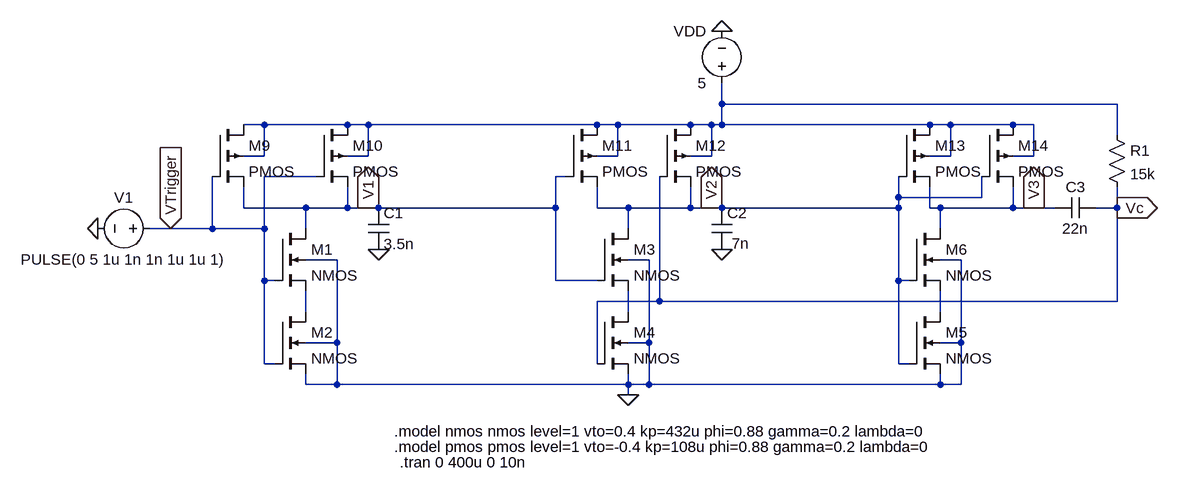
[diagram p0: schematic Lab05Pt2.asc]
Lab05Pt2.asc, the LTspice schematic file:
Version 4
SHEET 1 1176 680
WIRE 480 -112 480 -144
WIRE 1088 -112 480 -112
WIRE -224 -80 -256 -80
WIRE -96 -80 -224 -80
WIRE -64 -80 -96 -80
WIRE 288 -80 -64 -80
WIRE 320 -80 288 -80
WIRE 432 -80 320 -80
WIRE 464 -80 432 -80
WIRE 480 -80 480 -112
WIRE 480 -80 464 -80
WIRE 800 -80 480 -80
WIRE 832 -80 800 -80
WIRE 928 -80 832 -80
WIRE 960 -80 928 -80
WIRE 1088 -64 1088 -112
WIRE -224 -32 -224 -80
WIRE -224 -32 -256 -32
WIRE -64 -32 -64 -80
WIRE -64 -32 -96 -32
WIRE 320 -32 320 -80
WIRE 320 -32 288 -32
WIRE 464 -32 464 -80
WIRE 464 -32 432 -32
WIRE 832 -32 832 -80
WIRE 832 -32 800 -32
WIRE 960 -32 960 -80
WIRE 960 -32 928 -32
WIRE -144 0 -224 0
WIRE 240 0 224 0
WIRE 752 32 752 0
WIRE 880 32 880 0
WIRE 880 32 752 32
WIRE -256 48 -256 16
WIRE -160 48 -256 48
WIRE -96 48 -96 16
WIRE -96 48 -160 48
WIRE -64 48 -96 48
WIRE -48 48 -64 48
WIRE 224 48 224 0
WIRE 224 48 -48 48
WIRE 288 48 288 16
WIRE 336 48 288 48
WIRE 432 48 432 16
WIRE 432 48 336 48
WIRE 464 48 432 48
WIRE 480 48 464 48
WIRE 752 48 752 32
WIRE 752 48 480 48
WIRE 800 48 800 16
WIRE 816 48 800 48
WIRE 928 48 928 16
WIRE 928 48 816 48
WIRE 960 48 928 48
WIRE 992 48 960 48
WIRE 1088 48 1088 16
WIRE 1088 48 1056 48
WIRE -368 80 -400 80
WIRE -304 80 -304 0
WIRE -304 80 -368 80
WIRE -224 80 -224 0
WIRE -224 80 -304 80
WIRE -160 80 -160 48
WIRE 336 80 336 48
WIRE 816 80 816 48
WIRE -112 128 -160 128
WIRE 368 128 336 128
WIRE 848 128 816 128
WIRE -224 160 -224 80
WIRE -208 160 -224 160
WIRE 224 160 224 48
WIRE 288 160 224 160
WIRE 752 160 752 48
WIRE 768 160 752 160
WIRE 384 192 384 0
WIRE 384 192 288 192
WIRE 1088 192 1088 48
WIRE 1088 192 384 192
WIRE -160 208 -160 176
WIRE 336 208 336 176
WIRE 816 208 816 176
WIRE -112 256 -112 128
WIRE -112 256 -160 256
WIRE 368 256 368 128
WIRE 368 256 336 256
WIRE 848 256 848 128
WIRE 848 256 816 256
WIRE -224 288 -224 160
WIRE -208 288 -224 288
WIRE 288 288 288 192
WIRE 752 288 752 160
WIRE 768 288 752 288
WIRE -160 320 -160 304
WIRE -112 320 -112 256
WIRE -112 320 -160 320
WIRE 336 320 336 304
WIRE 336 320 -112 320
WIRE 368 320 368 256
WIRE 368 320 336 320
WIRE 816 320 816 304
WIRE 816 320 368 320
WIRE 848 320 848 256
WIRE 848 320 816 320
WIRE 336 336 336 320
FLAG 480 -224 0
FLAG 960 48 V3
IOPIN 960 48 Out
FLAG -64 48 V1
IOPIN -64 48 Out
FLAG -48 112 0
FLAG 480 112 0
FLAG 464 48 V2
IOPIN 464 48 Out
FLAG 336 336 0
FLAG -368 80 VTrigger
IOPIN -368 80 In
FLAG -480 80 0
FLAG 1088 48 Vc
IOPIN 1088 48 Out
SYMBOL nmos4 -208 80 R0
SYMATTR InstName M1
SYMATTR Value2 l=0.1u w=4u
SYMBOL nmos4 -208 208 R0
SYMATTR InstName M2
SYMATTR Value2 l=0.1u w=4u
SYMBOL nmos4 288 80 R0
SYMATTR InstName M3
SYMATTR Value2 l=0.1u w=4u
SYMBOL nmos4 288 208 R0
SYMATTR InstName M4
SYMATTR Value2 l=0.1u w=4u
SYMBOL nmos4 768 208 R0
SYMATTR InstName M5
SYMATTR Value2 l=0.1u w=4u
SYMBOL nmos4 768 80 R0
SYMATTR InstName M6
SYMATTR Value2 l=0.1u w=4u
SYMBOL pmos4 -304 -80 R0
SYMATTR InstName M9
SYMATTR Value2 l=0.1u w=4u
SYMBOL pmos4 -144 -80 R0
SYMATTR InstName M10
SYMATTR Value2 l=0.1u w=4u
SYMBOL pmos4 240 -80 R0
SYMATTR InstName M11
SYMATTR Value2 l=0.1u w=4u
SYMBOL pmos4 384 -80 R0
SYMATTR InstName M12
SYMATTR Value2 l=0.1u w=4u
SYMBOL pmos4 752 -80 R0
SYMATTR InstName M13
SYMATTR Value2 l=0.1u w=4u
SYMBOL pmos4 880 -80 R0
SYMATTR InstName M14
SYMATTR Value2 l=0.1u w=4u
SYMBOL voltage 480 -128 R180
WINDOW 0 24 96 Left 2
WINDOW 3 24 16 Left 2
WINDOW 123 0 0 Left 0
WINDOW 39 0 0 Left 0
SYMATTR InstName VDD
SYMATTR Value 5
SYMBOL cap -64 48 R0
SYMATTR InstName C1
SYMATTR Value 3.5n
SYMBOL cap 464 48 R0
WINDOW 3 31 55 Left 2
SYMATTR InstName C2
SYMATTR Value 7n
SYMBOL res 1072 -80 R0
SYMATTR InstName R1
SYMATTR Value 15k
SYMBOL cap 1056 32 R90
WINDOW 0 0 32 VBottom 2
WINDOW 3 32 32 VTop 2
SYMATTR InstName C3
SYMATTR Value 22n
SYMBOL voltage -384 80 R90
WINDOW 0 -32 56 VBottom 2
WINDOW 3 32 56 VTop 2
WINDOW 123 0 0 Left 0
WINDOW 39 0 0 Left 0
SYMATTR InstName V1
SYMATTR Value PULSE(0 5 1u 1n 1n 1u 1u 1)
TEXT -24 392 Left 2 !.model nmos nmos level=1 vto=0.4 kp=432u phi=0.88 gamma=0.2 lambda=0
TEXT -24 416 Left 2 !.model pmos pmos level=1 vto=-0.4 kp=108u phi=0.88 gamma=0.2 lambda=0
TEXT -16 440 Left 2 !.tran 0 400u 0 10n

The netlist it stands for:
* Lab05Pt2.asc
M1 V1 VTrigger N002 0 NMOS l=0.1u w=4u
M2 N002 VTrigger 0 0 NMOS l=0.1u w=4u
M3 V2 V1 N003 0 NMOS l=0.1u w=4u
M4 N003 Vc 0 0 NMOS l=0.1u w=4u
M5 N004 V2 0 0 NMOS l=0.1u w=4u
M6 V3 V2 N004 0 NMOS l=0.1u w=4u
M9 N001 VTrigger V1 N001 PMOS l=0.1u w=4u
M10 N001 VTrigger V1 N001 PMOS l=0.1u w=4u
M11 N001 V1 V2 N001 PMOS l=0.1u w=4u
M12 N001 Vc V2 N001 PMOS l=0.1u w=4u
M13 N001 V2 V3 N001 PMOS l=0.1u w=4u
M14 N001 V2 V3 N001 PMOS l=0.1u w=4u
VDD N001 0 5
C1 V1 0 3.5n
C2 V2 0 7n
R1 N001 Vc 15k
C3 Vc V3 22n
V1 VTrigger 0 PULSE(0 5 1u 1n 1n 1u 1u 1)
.model NMOS NMOS
.model PMOS PMOS
.lib standard.mos
.model nmos nmos level=1 vto=0.4 kp=432u phi=0.88 gamma=0.2 lambda=0
.model pmos pmos level=1 vto=-0.4 kp=108u phi=0.88 gamma=0.2 lambda=0
.tran 0 400u 0 10n
.backanno
.end

* Results of the author's LTspice run, read from the files saved beside the schematic
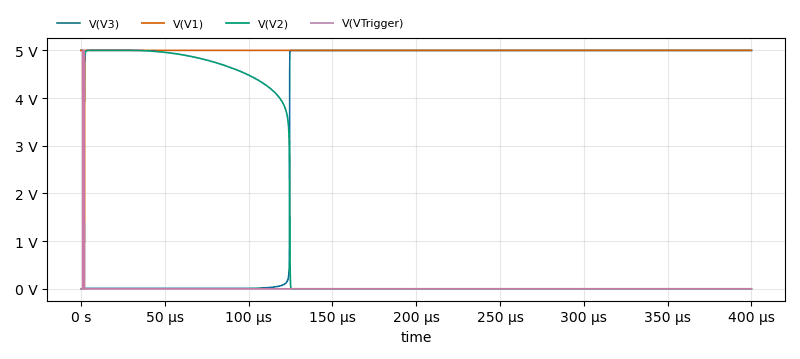
[diagram p1: Transient Analysis of Lab05Pt2.asc, plotted from the saved traces]
* Transient Analysis, 1 run:
*   V(V3): min 6.974 mV, max 5 V, average 3.468 V, rms 4.16 V, last 4.999 V
*   V(V1): min 131.8 µV, max 5 V, average 4.988 V, rms 4.993 V, last 5 V
*   V(V2): min 0 V, max 5 V, average 1.455 V, rms 2.629 V, last 0 V
*   V(VTrigger): min 0 V, max 5 V, average 12.51 mV, rms 250.1 mV, last 0 V